# EAGLE board tigor_mbed_rev_b_print (EAGLE 6.3)
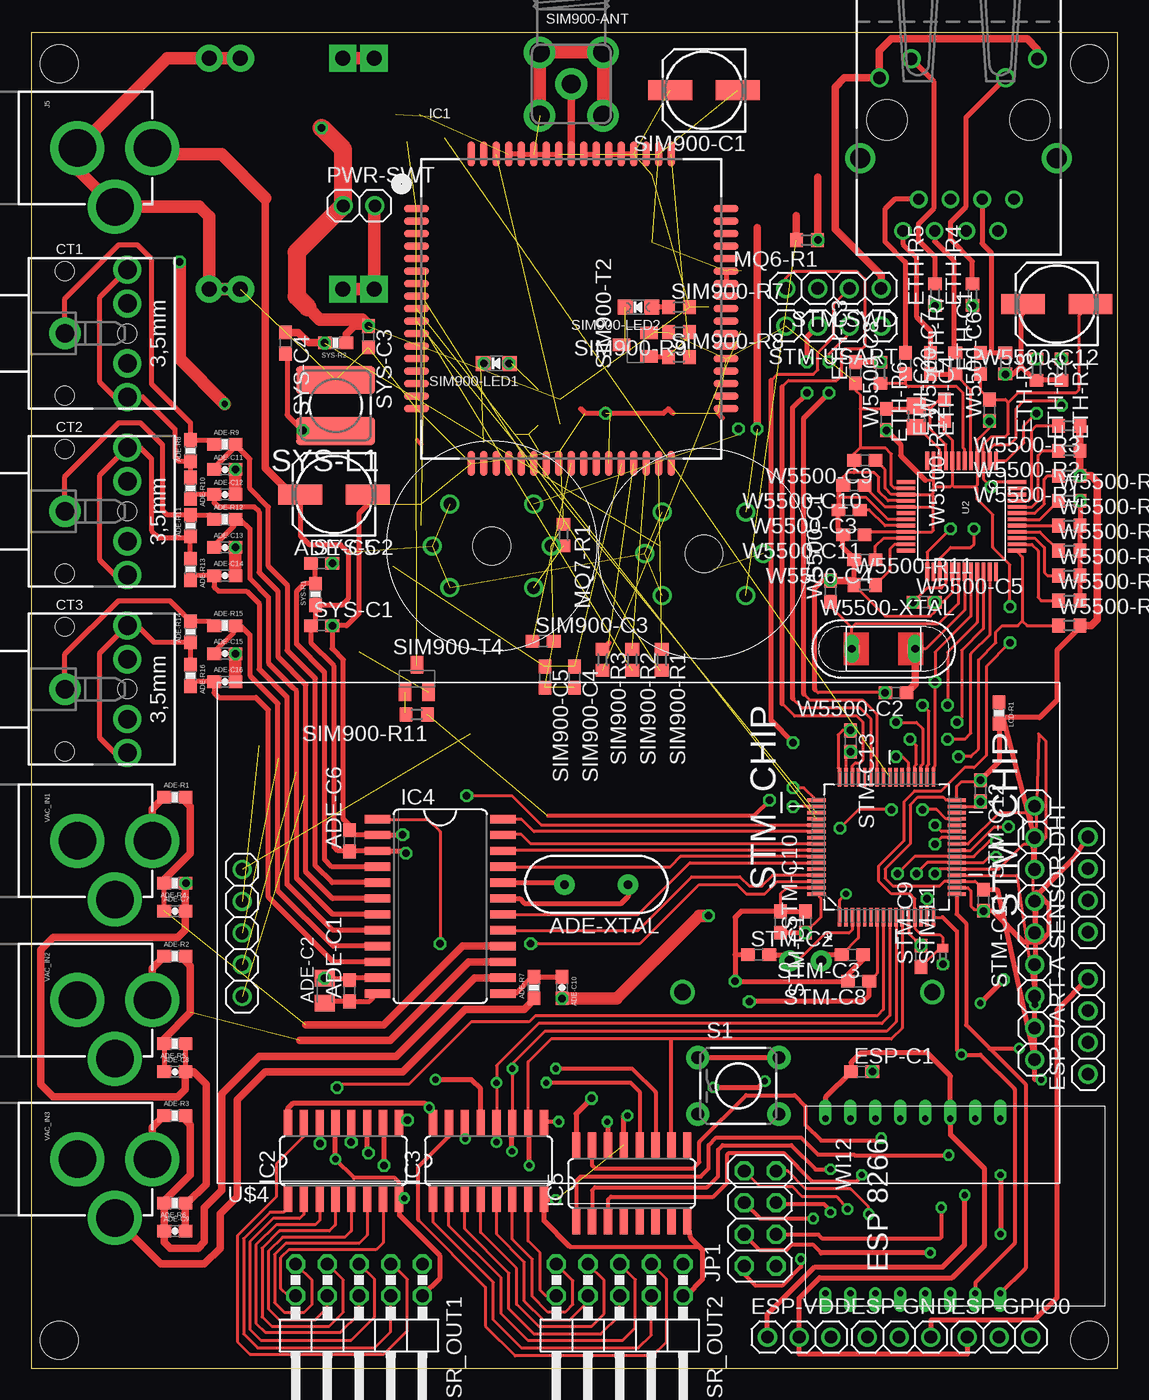
[diagram p2: board, top side]
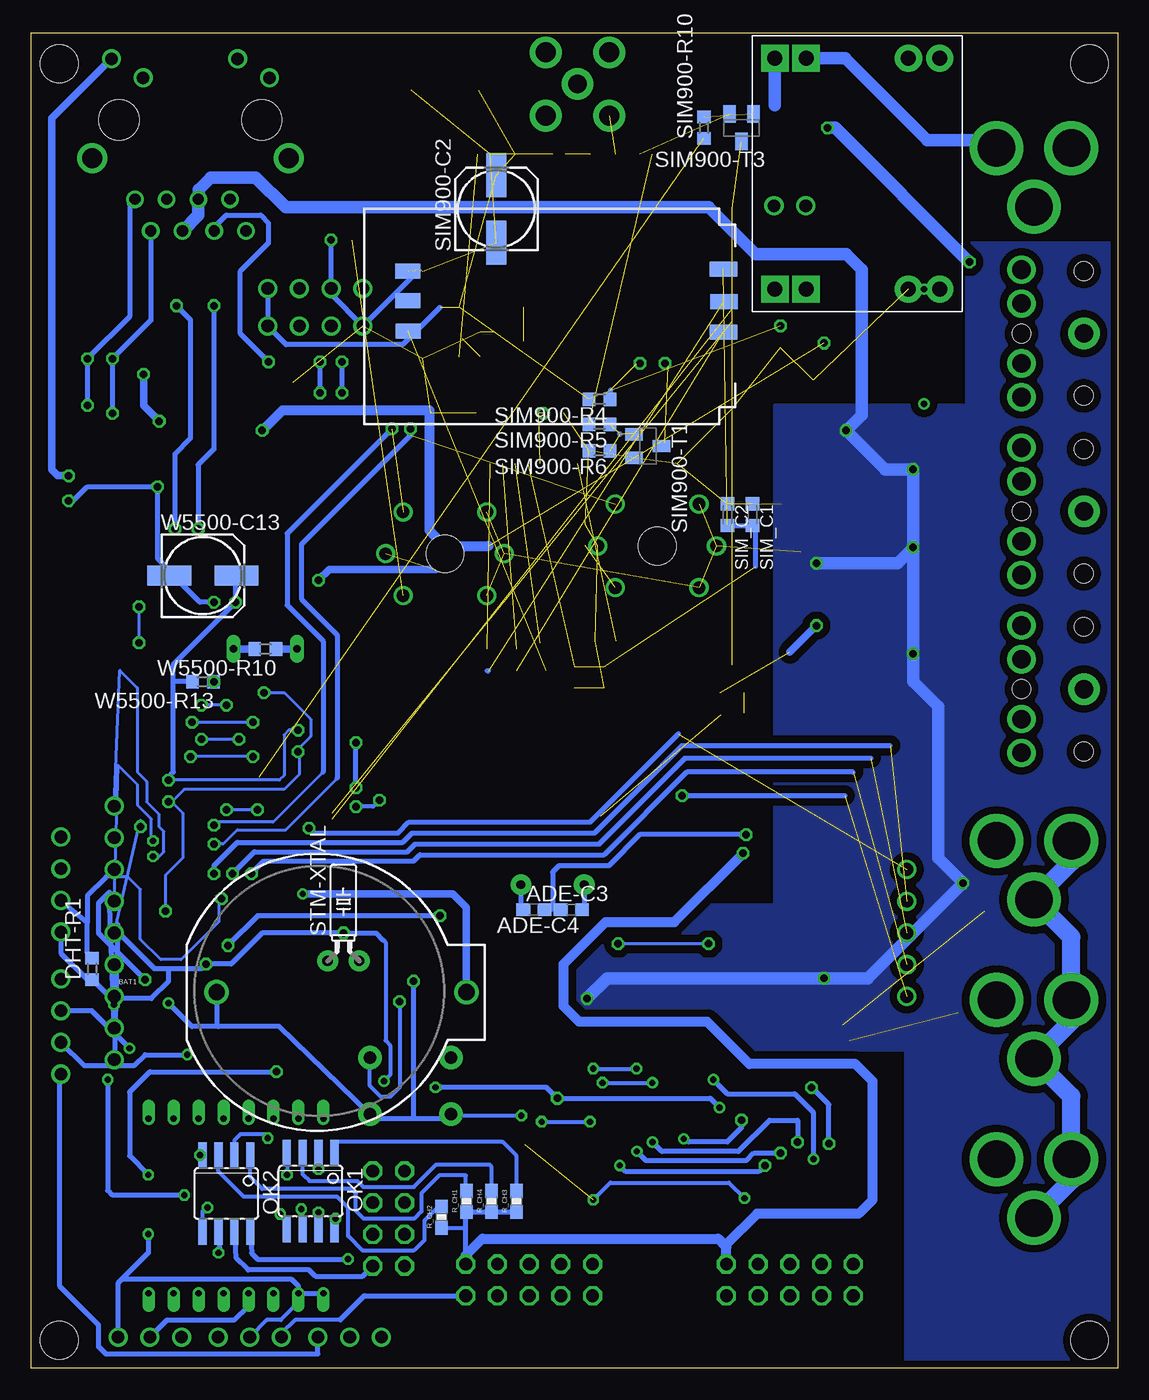
[diagram p3: board, bottom side, seen from below]

Size 87 x 107 mm. Coordinates in mm from the lower left corner, seen from the top.
Outline: 87,0 87,107 0,107 0,0 87,0
Copper layers (1*16): Top 0.035mm / dielectric 1.5mm / Bottom 0.035mm
Design rules "default *": minimum track width 10mil, minimum drill 10mil, track to track 0.125mm, track to pad 0.125mm, pad to pad 0.125mm, via to via 0.125mm, smd to smd 0mil, copper to edge 0.5mm, drill to drill 0.2mm, minimum pad ring 10mil, minimum via ring 8mil, stop-mask expansion 4mil, vias tented up to drill 0mil, thermal gap 10mil
Net classes: 1 power: width 0.305 mm, drill 0.6 mm, clearance 0.254 mm; 2 gnd: width 0.254 mm, drill 0.6 mm, clearance 0.254 mm
Holes 3 mm at 2.25,2.25 84.75,2.25 2.25,104.5 84.75,104.5

## Footprints (pad centres in the part's own frame; a part is rotated, then mirrored left to right if it is on the bottom)
C0603 = smd 1.1 x 1: 1 -0.85,0; 2 0.85,0
C0805K = smd 1.3 x 1.6: 1 -1,0; 2 1,0
153CLV-0605 = smd 3.5 x 1.6: + 2.7,0; - -2.7,0
0603-CAP = smd 1.1 x 1: 1 -0.85,0; 2 0.85,0
0603-RES = smd 1.1 x 1: 1 -0.85,0; 2 0.85,0
HC49US = drill 0.7 pad 1.651: 1 -2.54,0; 2 2.54,0
BATTCOM_20MM_PTH = drill 1.3: 1 11.85,0; 2 -8.15,0
STX3100 = drill 1.5 pad 2.54: 1 2.7,-0.1 | drill 1.5: 2 7.7,5; 3 7.7,2.3; 4 7.7,-2.5; 5 7.7,-5.2 | hole 1.5: 2.7,4.9; 2.7,-5.1; 7.7,-0.1
DCDCMODULE-SMALL = drill 1.2 pad 2.184: INM#1 1.8,15; INM#2 1.8,12.5; OUTM#1 20.3,15; OUTM#2 20.3,12.5 | drill 1.2 pad 2.184 square: INP#1 1.8,4.3; INP#2 1.8,1.8; OUTP#1 20.3,4.3; OUTP#2 20.3,1.8
R0603 = smd 1 x 1.1: 1 -0.85,0; 2 0.85,0
1X03 = drill 1.016: 1 -2.54,0; 2 0,0; 3 2.54,0
PINHD4 = drill 1.016: 1 -3.81,0; 2 -1.27,0; 3 1.27,0; 4 3.81,0
RJ45_PULSEJACK = drill 0.9: 1 4.445,-6.35; 2 3.175,-8.89; 3 1.905,-6.35; 4 0.635,-8.89; 5 -0.635,-6.35; 6 -1.905,-8.89; 7 -3.175,-6.35; 8 -4.445,-8.89 | drill 1: 9 6.325,4.9; 10 3.785,3.38; 11 -3.785,4.9; 12 -6.325,3.38 | drill 1.6: P$5 -7.875,-3.05; P$6 7.875,-3.05 | hole 3.2: -5.715,0; 5.715,0
SIM900_SMT = smd 2 x 0.6: P$1 -12.4,8; P$2 -12.4,7; P$3 -12.4,6; P$4 -12.4,5; P$5 -12.4,4; P$6 -12.4,3; P$7 -12.4,2; P$8 -12.4,1; P$9 -12.4,0; P$10 -12.4,-1; P$11 -12.4,-2; P$12 -12.4,-3; P$13 -12.4,-4; P$14 -12.4,-5; P$15 -12.4,-6; P$16 -12.4,-7; P$17 -12.4,-8; P$35 12.4,-8; P$36 12.4,-7; P$37 12.4,-6; P$38 12.4,-5; P$39 12.4,-4; P$40 12.4,-3; P$41 12.4,-2; P$42 12.4,-1; P$43 12.4,0; P$44 12.4,1; P$45 12.4,2; P$46 12.4,3; P$47 12.4,4; P$48 12.4,5; P$49 12.4,6; P$50 12.4,7; P$51 12.4,8 | smd 0.6 x 2: P$18 -8,-12.4; P$19 -7,-12.4; P$20 -6,-12.4; P$21 -5,-12.4; P$22 -4,-12.4; P$23 -3,-12.4; P$24 -2,-12.4; P$25 -1,-12.4; P$26 0,-12.4; P$27 1,-12.4; P$28 2,-12.4; P$29 3,-12.4; P$30 4,-12.4; P$31 5,-12.4; P$32 6,-12.4; P$33 7,-12.4; P$34 8,-12.4; P$52 8,12.4; P$53 7,12.4; P$54 6,12.4; P$55 5,12.4; P$56 4,12.4; P$57 3,12.4; P$58 2,12.4; P$59 1,12.4; P$60 0,12.4; P$61 -1,12.4; P$62 -2,12.4; P$63 -3,12.4; P$64 -4,12.4; P$65 -5,12.4; P$66 -6,12.4; P$67 -7,12.4; P$68 -8,12.4
SO16 = smd 0.66 x 2.032: 1 -4.445,-3.073; 2 -3.175,-3.073; 3 -1.905,-3.073; 4 -0.635,-3.073; 5 0.635,-3.073; 6 1.905,-3.073; 7 3.175,-3.073; 8 4.445,-3.073; 9 4.445,3.073; 10 3.175,3.073; 11 1.905,3.073; 12 0.635,3.073; 13 -0.635,3.073; 14 -1.905,3.073; 15 -3.175,3.073; 16 -4.445,3.073
SOIC24 = smd 0.66 x 2.032: 1 -6.985,-5.029; 2 -5.715,-5.029; 3 -4.445,-5.029; 4 -3.175,-5.029; 5 -1.905,-5.029; 6 -0.635,-5.029; 7 0.635,-5.029; 8 1.905,-5.029; 9 3.175,-5.029; 10 4.445,-5.029; 11 5.715,-5.029; 12 6.985,-5.029; 13 6.985,5.029; 14 5.715,5.029; 15 4.445,5.029; 16 3.175,5.029; 17 1.905,5.029; 18 0.635,5.029; 19 -0.635,5.029; 20 -1.905,5.029; 21 -3.175,5.029; 22 -4.445,5.029; 23 -5.715,5.029; 24 -6.985,5.029
POWER_JACK_PTH = drill 2.997 pad 4.318: GND 0,7.7; GNDBREAK 4.7,10.7; PWR 0,13.7
2X04 = drill 1.016 octagon: 1 -3.81,-1.27; 2 -3.81,1.27; 3 -1.27,-1.27; 4 -1.27,1.27; 5 1.27,-1.27; 6 1.27,1.27; 7 3.81,-1.27; 8 3.81,1.27
SOIC08 = smd 0.66 x 2.032: 1 -1.905,-3.073; 2 -0.635,-3.073; 3 0.635,-3.073; 4 1.905,-3.073; 5 1.905,3.073; 6 0.635,3.073; 7 -0.635,3.073; 8 -1.905,3.073
PINHD2 = drill 1.016: 1 -1.27,0; 2 1.27,0
TACTILE-PTH = drill 1.016 pad 1.88: 1 -3.251,2.261; 2 3.251,2.261; 3 -3.251,-2.261; 4 3.251,-2.261
MQ-3 = drill 1.016: A1 -3.35,3.35; A2 -3.35,-3.35; B1 3.35,3.35; B2 3.35,-3.35; HA -4.75,0; HB 4.75,0 | hole 3: 0,0
SMA90_DIP = drill 1.5 pad 2.54: ANTENNA 0,0 | drill 1.6 pad 2.54: GND1 -2.54,2.54; GND2 2.54,2.54; GND3 -2.54,-2.54; GND4 2.54,-2.54
CHIPLED_0805_NOOUTLINE = smd 1.2 x 1.2: A 0,-1.05; C 0,1.05
SOT23-BEC = smd 1 x 1.4: B -0.95,-1.1; C 0,1.1; E 0.95,-1.1
C0603K = smd 1.05 x 1.08: 1 -0.875,0; 2 0.875,0
SIMHOLDER3 = smd 2.2 x 1.2: 1 0.95,4.81; 2 0.91,7.41; 3 0.95,9.86 | smd 2 x 1.2: 4 26.2,9.78; 5 26.22,7.34; 6 26.22,4.98
2X05/90 = drill 1.016 octagon: 1 -5.08,-6.35; 2 -5.08,-3.81; 3 -2.54,-6.35; 4 -2.54,-3.81; 5 0,-6.35; 6 0,-3.81; 7 2.54,-6.35; 8 2.54,-3.81; 9 5.08,-6.35; 10 5.08,-3.81
0402 = smd 0.7 x 0.9: 1 -0.65,0; 2 0.65,0
TC26H = drill 0.813 pad 1.676: 1 -1.27,0; 2 1.27,0
QFP50P1200X1200X160-64N = smd 1.473 x 0.279: 1 -5.613,3.759; 2 -5.613,3.251; 3 -5.613,2.743; 4 -5.613,2.261; 5 -5.613,1.753; 6 -5.613,1.245; 7 -5.613,0.762; 8 -5.613,0.254; 9 -5.613,-0.254; 10 -5.613,-0.762; 11 -5.613,-1.245; 12 -5.613,-1.753; 13 -5.613,-2.261; 14 -5.613,-2.743; 15 -5.613,-3.251; 16 -5.613,-3.759; 33 5.613,-3.759; 34 5.613,-3.251; 35 5.613,-2.743; 36 5.613,-2.261; 37 5.613,-1.753; 38 5.613,-1.245; 39 5.613,-0.762; 40 5.613,-0.254; 41 5.613,0.254; 42 5.613,0.762; 43 5.613,1.245; 44 5.613,1.753; 45 5.613,2.261; 46 5.613,2.743; 47 5.613,3.251; 48 5.613,3.759 | smd 0.279 x 1.473: 17 -3.759,-5.613; 18 -3.251,-5.613; 19 -2.743,-5.613; 20 -2.261,-5.613; 21 -1.753,-5.613; 22 -1.245,-5.613; 23 -0.762,-5.613; 24 -0.254,-5.613; 25 0.254,-5.613; 26 0.762,-5.613; 27 1.245,-5.613; 28 1.753,-5.613; 29 2.261,-5.613; 30 2.743,-5.613; 31 3.251,-5.613; 32 3.759,-5.613; 49 3.759,5.613; 50 3.251,5.613; 51 2.743,5.613; 52 2.261,5.613; 53 1.753,5.613; 54 1.245,5.613; 55 0.762,5.613; 56 0.254,5.613; 57 -0.254,5.613; 58 -0.762,5.613; 59 -1.245,5.613; 60 -1.753,5.613; 61 -2.261,5.613; 62 -2.743,5.613; 63 -3.251,5.613; 64 -3.759,5.613
POWER-CHOKE_WE-TPC = smd 6.3 x 2.2: 1 0,2.05; 2 0,-2.05
W5500 = smd 1.5 x 0.3: 1 -4.45,2.75; 2 -4.45,2.25; 3 -4.45,1.75; 4 -4.45,1.25; 5 -4.45,0.75; 6 -4.45,0.25; 7 -4.45,-0.25; 8 -4.45,-0.75; 9 -4.45,-1.25; 10 -4.45,-1.75; 11 -4.45,-2.25; 12 -4.45,-2.75; 25 4.45,-2.75; 26 4.45,-2.25; 27 4.45,-1.75; 28 4.45,-1.25; 29 4.45,-0.75; 30 4.45,-0.25; 31 4.45,0.25; 32 4.45,0.75; 33 4.45,1.25; 34 4.45,1.75; 35 4.45,2.25; 36 4.45,2.75 | smd 0.3 x 1.5: 13 -2.75,-4.45; 14 -2.25,-4.45; 15 -1.75,-4.45; 16 -1.25,-4.45; 17 -0.75,-4.45; 18 -0.25,-4.45; 19 0.25,-4.45; 20 0.75,-4.45; 21 1.25,-4.45; 22 1.75,-4.45; 23 2.25,-4.45; 24 2.75,-4.45; 37 2.75,4.45; 38 2.25,4.45; 39 1.75,4.45; 40 1.25,4.45; 41 0.75,4.45; 42 0.25,4.45; 43 -0.25,4.45; 44 -0.75,4.45; 45 -1.25,4.45; 46 -1.75,4.45; 47 -2.25,4.45; 48 -2.75,4.45
CRISTAL-ABM7 = smd 1.27 x 0.635: P$1 -2.54,0; P$2 2.54,0
TFT_LCD_2.2+F_CS = drill 1.016: F_CS -31.86,5.08; LCD_CS 31.6,-5.08; LCD_D/C 31.6,0; LCD_GND 31.6,-7.62; LCD_LED 31.6,7.62; LCD_MISO 31.6,10.16; LCD_MOSI 31.6,2.54; LCD_RESET 31.6,-2.54; LCD_SCK 31.6,5.08; LCD_VCC 31.6,-10.16; SD_CS -31.86,-5.08; SD_MISO -31.86,0; SD_MOSI -31.86,-2.54; SD_SCK -31.86,2.54
WI12 = drill 0.5 pad 0.813 offset: ADC 10.4,1; CH_PD 12.4,1; GND 22.4,15; GPIO00 16.4,15; GPIO02 18.4,15; GPIO04 12.4,15; GPIO05 14.4,15; GPIO12 18.4,1; GPIO13 20.4,1; GPIO14 16.4,1; GPIO15 20.4,15; GPIO16 14.4,1; REST 8.4,1; RXD 10.4,15; TXD 8.4,15; VCC 22.4,1
R0805 = smd 1.3 x 1.5: 1 -0.85,0; 2 0.85,0
QS = drill 0.61 long: 1 -2.54,0; 2 2.54,0

## Placement (x,y rotation side)
ADE-C1  0.1uF  [C0603]  25.5,30.25 90 top
ADE-C2  10uF  [C0805K]  23.5,30.25 90 top
ADE-C3  22pF  [C0603]  46.75,36.75 0 bottom
ADE-C4  22pF  [C0603]  43.75,36.75 180 bottom
ADE-C5  10uF  [153CLV-0605]  24.25,70 180 top
ADE-C6  100nF  [C0603]  25.5,42.25 90 top
ADE-C7  33nF  [0603-CAP]  11.5,36.62 0 top
ADE-C8  33nF  [0603-CAP]  11.5,23.75 0 top
ADE-C9  33nF  [0603-CAP]  11.5,11 0 top
ADE-C10  33nF  [0603-CAP]  42.5,30.5 270 top
ADE-C11  33nF  [0603-CAP]  15.5,72 0 top
ADE-C12  33nF  [0603-CAP]  15.5,70 0 top
ADE-C13  33nF  [0603-CAP]  15.5,65.75 0 top
ADE-C14  33nF  [0603-CAP]  15.5,63.5 0 top
ADE-C15  33nF  [0603-CAP]  15.5,57.25 0 top
ADE-C16  33nF  [0603-CAP]  15.5,55 0 top
ADE-R1  81K  [0603-RES]  11.5,45.75 0 top
ADE-R2  81K  [0603-RES]  11.5,33 0 top
ADE-R3  81K  [0603-RES]  11.5,20.25 0 top
ADE-R4  1K  [0603-RES]  11.5,38.88 180 top
ADE-R5  1K  [0603-RES]  11.5,26 180 top
ADE-R6  1K  [0603-RES]  11.5,13.25 180 top
ADE-R7  1K  [0603-RES]  40.25,30.5 90 top
ADE-R8  33R  [0603-RES]  12.75,73.5 90 top
ADE-R9  1K  [0603-RES]  15.5,74 0 top
ADE-R10  1K  [0603-RES]  12.75,70.5 270 top
ADE-R11  33R  [0603-RES]  12.75,67.5 90 top
ADE-R12  1K  [0603-RES]  15.5,68 0 top
ADE-R13  1K  [0603-RES]  12.75,64 270 top
ADE-R14  33R  [0603-RES]  12.75,59 90 top
ADE-R15  1K  [0603-RES]  15.5,59.5 0 top
ADE-R16  1K  [0603-RES]  12.75,55.5 270 top
ADE-XTAL  10MHz  [HC49US]  45.25,38.75 180 top
BAT1  [BATTCOM_20MM_PTH]  64,30.12 0 bottom
CT1  100A  [STX3100]  0,83 0 top
CT2  100A  [STX3100]  0,68.75 0 top
CT3  100A  [STX3100]  0,54.5 0 top
DCDC-3.5V  DCDCMODULE_SMALL  [DCDCMODULE-SMALL]  29.25,106.75 270 bottom
DHT-R1  10k  [R0603]  82.12,32 90 bottom
ESP-C1  100nF  [C0603]  66.5,23.75 0 top
ESP-GND  [1X03]  69.5,2.5 0 top
ESP-GPIO0  [1X03]  77.5,2.5 0 top
ESP-UART-A  PINHD4  [PINHD4]  84.62,27.38 90 top
ESP-VDD  [1X03]  61.5,2.5 0 top
ETH-C1  22nF  [C0603]  76,80.5 90 top
ETH-C2  6.8nF  [C0603]  70,80.5 270 top
ETH-C3  10nF  [C0603]  66,79.75 90 top
ETH-C4  6.8nF  [C0603]  72,80.5 270 top
ETH-R1  49R9  [R0603]  82.5,80 270 top
ETH-R2  49R9  [R0603]  80.5,80 270 top
ETH-R3  10R  [R0603]  78,80.5 270 top
ETH-R4  330  [R0603]  75.38,86 90 top
ETH-R5  330  [R0603]  72.38,86 90 top
ETH-R6  49R9  [R0603]  68,79.75 270 top
ETH-R7  49R9  [R0603]  74,80.5 90 top
ETHERNET  [RJ45_PULSEJACK]  74.25,100 0 top
IC1  SIM900  [SIM900_SMT]  43.25,84.88 0 top
IC2  74HC595D  [SO16]  25,16.62 0 top
IC3  74HC595D  [SO16]  36.62,16.62 0 top
IC4  ADE7758RW  [SOIC24]  32.75,37 270 top
IC5  74HC595D  [SO16]  48.09,14.81 0 top
J5  POWER_JACKPTH  [POWER_JACK_PTH]  -4,97.75 270 top
JP1  [2X04]  58.38,12 90 top
LCD-R1  680R  [0603-RES]  77.5,52.5 270 top
MQ6-R1  10k  [R0603]  62.12,90.38 180 top
MQ7-R1  10k  [R0603]  42.62,66.75 270 top
OK1  ILD205  [SOIC08]  64.62,14.2 180 bottom
OK2  ILD205  [SOIC08]  71.38,14 180 bottom
PWR-SWT  PINHD2  [PINHD2]  26.25,93.12 0 top
R_CH1  270  [0603-RES]  52.12,13.38 90 bottom
R_CH2  270  [0603-RES]  54.14,12.11 90 bottom
R_CH3  270  [0603-RES]  48.12,13.38 90 bottom
R_CH4  270  [0603-RES]  50.12,13.38 90 bottom
S1  [TACTILE-PTH]  56.62,22.62 0 top
SENSOR-DHT  PINHD4  [PINHD4]  84.62,38.75 90 top
SENSOR-MQ6  METHANE_SENSOR  [MQ-3]  53.88,65.25 0 top
SENSOR-MQ7  METHANE_SENSOR  [MQ-3]  36.88,65.88 0 top
SIM900-ANT  [SMA90_DIP]  43.25,102.88 0 top
SIM900-C1  100uF  [153CLV-0605]  53.88,102.38 180 top
SIM900-C2  100uF  [153CLV-0605]  49.75,92.88 90 bottom
SIM900-C3  4u7  [C0603]  41,58.25 0 top
SIM900-C4  100nF  [C0603]  43.5,55.38 270 top
SIM900-C5  22pF  [C0603]  41.12,55.38 270 top
SIM900-LED1  [CHIPLED_0805_NOOUTLINE]  37.25,80.5 90 top
SIM900-LED2  [CHIPLED_0805_NOOUTLINE]  48.62,85 90 top
SIM900-R1  22R  [R0603]  50.5,56.75 270 top
SIM900-R2  22R  [R0603]  48.12,56.75 270 top
SIM900-R3  22R  [R0603]  45.75,56.75 270 top
SIM900-R4  680R  [R0603]  41.5,77.62 180 bottom
SIM900-R5  1K  [R0603]  41.5,75.62 180 bottom
SIM900-R6  10K  [R0603]  41.5,73.5 180 bottom
SIM900-R7  680R  [R0603]  51.88,85 0 top
SIM900-R8  1K  [R0603]  51.88,81 0 top
SIM900-R9  10K  [R0603]  51.88,83 180 top
SIM900-R10  120R  [R0603]  33.12,99.38 90 bottom
SIM900-R11  120R  [R0603]  30.88,52.38 180 top
SIM900-T1  [SOT23-BEC]  37.62,73.88 270 bottom
SIM900-T2  [SOT23-BEC]  48.38,82 90 top
SIM900-T3  [SOT23-BEC]  30.12,99.38 180 bottom
SIM900-T4  [SOT23-BEC]  30.88,55.25 0 top
SIM_C1  100nF  [C0603K]  29.25,68.38 270 bottom
SIM_C2  22pF  [C0603K]  31.25,68.38 270 bottom
SIM_HOLDER  SIMHOLDER3  [SIMHOLDER3]  30.62,92.88 180 bottom
SR_OUT1  [2X05/90]  26.25,2 180 top
SR_OUT2  [2X05/90]  47.12,2 180 top
STM-C1  1uF  [C0603]  60,35.75 270 top
STM-C2  4.3pF  [C0603]  58.25,33.12 0 top
STM-C3  4.3pF  [C0603]  65.75,33.12 180 top
STM-C8  100nF  [C0603]  66.25,31 180 top
STM-C9  100nF  [C0603]  71.25,33 90 top
STM-C10  100nF  [C0603]  62,35.75 90 top
STM-C11  100nF  [C0603]  76.25,37.5 270 top
STM-C12  100nF  [C0603]  76,46.25 270 top
STM-C13  100nF  [C0603]  65.62,50.25 270 top
STM-L1  BLM15HB121SN1  [0402]  73,33 90 top
STM-SWD  PINHD4  [PINHD4]  64.25,86.5 180 top
STM-USART  PINHD4  [PINHD4]  64.25,83.5 180 top
STM-XTAL  32.768kHz  [TC26H]  62,32.62 0 bottom
STM_CHIP  STM32F103RBT6  [QFP50P1200X1200X160-64N]  68.5,41.75 90 top
SYS-C1  0.1uF  [C0603]  23.25,59.5 0 top
SYS-C2  0.1uF  [C0603]  23.25,64.5 0 top
SYS-C3  0.1uF  [C0603]  27,82.62 270 top
SYS-C4  0.1uF  [C0603]  20.38,82.12 270 top
SYS-L1  150Mhz  [POWER-CHOKE_WE-TPC]  24.38,77.12 180 top
SYS-R1  10R  [0603-RES]  22.75,62 90 top
SYS-R2  10R  [0603-RES]  24.38,82.12 180 top
U2  W5500  [W5500]  74.5,68.25 270 top
U$3  CRISTAL-ABM7  [CRISTAL-ABM7]  68.25,57.62 0 top
U$4  TFT_LCD_2.2+F_CS  [TFT_LCD_2.2+F_CS]  48.75,34.88 0 top
U$5  ESP8266WI12  [WI12]  86,21 180 top
VAC_IN1  9V  [POWER_JACK_PTH]  -4,42.25 270 top
VAC_IN2  9V  [POWER_JACK_PTH]  -4,29.5 270 top
VAC_IN3  9V  [POWER_JACK_PTH]  -4,16.75 270 top
W5500-C1  18pF  [C0603]  64,62.25 90 top
W5500-C2  18pF  [C0603]  69.25,54.12 180 top
W5500-C3  4.7uF  [C0603]  65.5,68.75 180 top
W5500-C4  10nF  [C0603]  66.75,64.75 180 top
W5500-C5  100nF  [C0603]  71.5,61.38 0 top
W5500-C6  100nF  [C0603]  76.75,76.75 90 top
W5500-C7  100nF  [C0603]  73.12,76.75 90 top
W5500-C8  100nF  [C0603]  68.5,76 90 top
W5500-C9  100nF  [C0603]  66.75,72.75 180 top
W5500-C10  100nF  [C0603]  65.88,70.75 180 top
W5500-C11  100nF  [C0603]  65.88,66.75 180 top
W5500-C12  10uF/16V  [153CLV-0605]  82.12,85.25 180 top
W5500-C13  10uF/16V  [153CLV-0605]  73.25,63.5 0 bottom
W5500-R1  10k  [R0603]  83.12,71.5 180 top
W5500-R2  10k  [R0603]  83.12,73.5 180 top
W5500-R3  10k  [R0603]  83.12,75.5 180 top
W5500-R4  10k  [R0603]  83.12,69.5 0 top
W5500-R5  10k  [R0603]  83.12,67.5 0 top
W5500-R6  10k  [R0603]  83.12,65.5 0 top
W5500-R7  10k  [R0603]  83.12,63.5 0 top
W5500-R8  10k  [R0603]  83.12,61.5 0 top
W5500-R9  10k  [R0603]  83.12,59.5 0 top
W5500-R10  1M  [R0603]  68.25,57.62 180 bottom
W5500-R11  10k  [R0603]  66.75,62.75 0 top
W5500-R12  12K4  [R0805]  70.88,76.25 270 top
W5500-R13  10k  [R0603]  73.25,55 180 bottom
W5500-XTAL  25MHz  [QS]  68.25,57.62 0 top

## Tracks (layer width: path | path; a pad name or v marks a point on that pad's centre or on a via)
+5V  (via drill 0.6)  (6 unrouted)
  Top 0.406: 25.55,41.45 24.55,41.45 24.25,41.75 24.25,56.25 22.4,58.1 SYS-C1.1 22.75,59.85 SYS-R1.1 24.9,61.15 25.38,61.62 25.38,65.38 24.75,66 22.25,66 21.55,66.7 ADE-C5.+ | 25.55,41.45 IC4.3 29.8,41.45 v30,41.25 | 25.55,41.45 ADE-C6.1
  Top 0.61: ADE-C5.+ 20.88,70 18.75,72.12 18.75,93.75
  Top 1.016: DCDC-3.5V.INP#2 DCDC-3.5V.INP#1 | 18.75,93.75 15.25,97.25 10.2,97.25 J5.PWR
  Bottom 0.305: 52.23,11.65 52.2,11.62 | R_CH2.1 52.2,11.26
  Bottom 0.406: R_CH3.1 R_CH4.1 R_CH1.1 52.2,12.45 52.2,11.62 52.2,11.26 52.2,9.04
  Bottom 0.813: SR_OUT2.1 52.2,9.04 50.88,10.38 32,10.38 31.33,9.71 | SR_OUT1.1 31.33,9.71 | 31.33,9.71 31.33,9.92 28.88,12.38 20.75,12.38 19.62,13.5 19.62,23 21,24.38 29.5,24.38 32.88,27.75 43.12,27.75 44.38,29 44.38,32.38 41,35.75 35.5,35.75 v30,41.25
  Bottom 1.016: DCDC-3.5V.INP#2 27.45,101.17 | DCDC-3.5V.INP#1 21.83,104.95 15.25,98.38 10.33,98.38 J5.PWR
ACTLED  (via drill 0.6)
  Top 0.254: U2.27 72.75,64.88 73.62,65.75 75.25,65.75 75.5,66 v75.5,67.25
  Top 0.406: ETH-R4.1 v75.38,85.12
  Bottom 0.406: v75.38,85.12 74.25,84 74.25,74.5 75.5,73.25 v75.5,67.25
ADE_APCF  (via drill 0.6)
  Top 0.254: IC4.1 31.77,43.98 32.75,43 v32.75,34 | STM_CHIP.62 59.75,39 58.75,38 57.25,38 56.5,38.75 53.5,38.75 48.75,34 v40,34
  Bottom 0.254: v32.75,34 v40,34
ADE_CS
  Top 0.254: STM_CHIP.58 51.99,40.99 51.17,40.17 IC4.21
ADE_IRQ
  Top 0.254: IC4.18 48.62,36.37 52.75,40.5 STM_CHIP.59
ADE_MISO
  Top 0.254: 37.79,44 IC4.24 | 37.89,43.88 IC4.24 | STM_CHIP.54 40.25,43 39.27,43.98 IC4.24 | 38.01,43.75 IC4.24
ADE_MOSI
  Top 0.254: STM_CHIP.57 37.83,41.5 IC4.22
ADE_SCK
  Top 0.254: STM_CHIP.56 40,42 39.25,42.75 37.81,42.75 IC4.23
ADE_VARCF
  Top 0.254: IC4.17 48.59,35.09 52.88,39.38 56.75,39.38 57.5,38.62 58.5,38.62 59.38,39.5 59.39,39.49 STM_CHIP.61
AGND  (via drill 0.6)
  Top 0.254: STM_CHIP.12 70.25,34.85 STM-C9.2 v71.25,33.88 | v16.38,65.75 ADE-C13.2 | v12.38,38.88 ADE-R4.1 | ADE-C10.2 v42.5,29.62
  Top 0.305: ADE-C11.2 v16.38,72
  Top 0.406: ADE-R5.1 ADE-C8.2 | IC4.11 25.69,31.29 ADE-C1.2 25.35,31.25 ADE-C2.2 | SYS-L1.1 21.75,75.08 v21.75,75.12 20.5,76.38 20.5,81.15 SYS-C4.2 | v16.38,57.25 ADE-C15.2 | v24.12,64.5 SYS-C2.2
  Top 0.61: ADE-R4.1 ADE-C7.2 12.35,35.1 11.75,34.5 1.75,34.5 0.75,33.5 0.75,22.75 1.75,21.75 11.75,21.75 12.35,22.35 ADE-C8.2 13,23.75 14,22.75 14,14.75 12.5,13.25 ADE-R6.1 ADE-C9.2
  Top 1.016: ADE-C13.2 ADE-C14.2 | ADE-C15.2 ADE-C16.2 | ADE-C11.2 ADE-C12.2 | v42.5,29.62 46.88,29.62 53.5,36.25 v54.25,36.25
  Bottom 0.406: v42.5,29.62 42.38,29.62 | v54.25,36.25 68.88,36.25 v71.25,33.88
  Bottom 0.61: ETHERNET.5 73.6,93.65
  Bottom 1.016: ETHERNET.5 73.61,92.38 ETHERNET.4 | 73.6,93.65 73.6,94.4 72.62,95.38 69,95.38 66.62,93 32.75,93 29,89.25 21.75,89.25 20.5,88 20.5,76.38 v21.75,75.12 18.62,72 v16.38,72 v16.38,65.75 | v16.38,65.75 v16.38,57.25 16.38,55 14.38,53 14.38,40.88 v12.38,38.88 20,31.25 ADE-C2.2 40.88,31.25 v42.5,29.62 | v24.12,64.5 17.62,64.5 v16.38,65.75
  other vias: 23.5,31.25
  pour Bottom (isolate 0.61): -0.12,90.12 12.12,90.12 12.12,77.38 12.12,77.12 27.5,77.12 27.5,57.12 27.5,52.75 27.5,40.5 27.5,37.12 45.12,37.12 45.12,25.5 17,25.5 17,4.75 17,-0.25 -0.25,-0.25 -0.25,2.38 -0.25,23.62 -0.25,33.62 -0.25,90.12
AVDD
  Top 0.406: IC4.4 24.08,40.17 23.5,40.75 23.5,55.75 21.25,58 21.25,62.25 21.85,62.85 SYS-R1.2 22.75,64.15 SYS-C2.1
CH1_A  (via drill 0.5)
  Top 0.305: v61.62,8.75 61.62,8.12 60.12,6.62 58,6.62 57.11,7.52 JP1.2
  Top 0.406: 57.11,7.89 JP1.2
  Bottom 0.406: OK2.8 69.34,9.22 68.88,8.75 v61.62,8.75
CH1_B
  Bottom 0.406: OK2.7 70.61,8.87 69.64,7.89 64.76,7.89 64.25,7.38 60.46,7.38 JP1.1
CH1_IN  (via drill 0.5)
  Top 0.305: IC5.15 44.91,16.25 45.16,16 53,16 53.5,16.5 53.5,18.12 57.25,21.88 61.12,21.88 62,21 62,19.5 63.25,18.25 67.88,18.25 v68.06,18.44
  Bottom 0.305: v68.06,18.44 68.38,18.75 70.25,18.75 70.74,18.26 OK2.2
CH2_A  (via drill 0.5)
  Top 0.305: 63.25,9.25 62.62,9.88 60.88,9.88 60.46,9.46 58.33,9.46 57.11,10.68 JP1.4
  Top 0.406: v72,9.25 63.25,9.25
  Bottom 0.406: OK2.6 71.89,9.38 v72,9.25
CH2_B  (via drill 0.5)
  Top 0.305: v72.88,12.88 72.88,10.5 72.75,10.38 63.36,10.38 63.02,10.71 59.66,10.71 JP1.3
  Bottom 0.305: OK2.5 73.28,12.6 v72.88,12.88
CH2_IN  (via drill 0.5)
  Top 0.305: IC5.1 43.65,15 44.02,15.38 53.62,15.38 54.25,16 54.25,17.88 54.88,18.5 61.62,18.5 63,17.12 65.88,17.12 65.93,17.07 73.46,17.07 v73.47,17.09
  Bottom 0.254: v73.47,17.09 73.21,17.09
  Bottom 0.305: OK2.4 73.46,17.07 v73.47,17.09
CH3_A  (via drill 0.5)
  Top 0.305: v62.62,12 58.38,12 JP1.6 57.11,13.39
  Bottom 0.305: OK1.8 62.72,12.25 v62.62,12
CH3_B  (via drill 0.5)
  Top 0.305: JP1.5 59.78,13.14 63.49,13.14 64,12.62 v64,12.5
  Bottom 0.305: v64,12.5 v63.99,12.49 OK1.7
CH3_IN  (via drill 0.5)
  Top 0.305: IC5.2 44.91,14.25 45.16,14.5 54.12,14.5 55,15.38 55,17.5 55.38,17.88 60.88,17.88 62.81,15.94 v64,15.94
  Bottom 0.305: v64,15.94 OK1.2
CH4_A  (via drill 0.5)
  Top 0.254: v65.38,12.75 64.5,13.75 61.75,13.75 60.96,14.54 58.38,14.54 JP1.8
  Bottom 0.254: OK1.6 65.38,11.24 v65.38,12.75
CH4_B  (via drill 0.5)
  Top 0.254: v67.06,12.36 67.06,12.93 65.61,14.38 62,14.38 60.56,15.81 JP1.7
  Bottom 0.254: OK1.5 66.53,11.83 v67.06,12.36
CH4_IN  (via drill 0.5)
  Top 0.305: IC5.3 46.19,13.5 46.44,13.75 54.62,13.75 55.75,14.88 55.75,17.12 55.88,17.25 60.25,17.25 62.51,14.99 66.12,14.99 66.51,15.38 v66.51,15.5
  Bottom 0.305: OK1.4 66.51,17.26 v66.51,15.5
DC_VOUT
  Top 1.016: PWR-SWT.2 27.45,93.06 DCDC-3.5V.OUTP#2 DCDC-3.5V.OUTP#1
DGND  (via drill 0.5, 0.6)  (36 unrouted)
  Top 0.254: STM_CHIP.18 75,38.5 75.25,38.25 75.25,37 75.5,36.75 76.15,36.75 STM-C11.2 v76.25,36.62 | STM_CHIP.31 75.6,45 STM-C12.2 v76,45.38 | STM_CHIP.63 60.5,38.5 60,38 STM-C1.1 | U2.14 69.12,70.5 68.88,70.75 68.88,73.25 68.38,73.75 66.38,73.75 | U2.16 68.62,69.5 67.88,70.25 67.88,71.38 67.5,71.75 65.88,71.75 | U2.19 68.62,68 66.88,69.75 64.65,69.75 | 66.38,73.75 65.9,73.28 W5500-C9.2 65.9,71.78 65.88,71.75 | STM_CHIP.47 65.25,49.02 STM-C13.2 65.35,49.38 v65.62,49.38 | 65.88,71.75 65.38,71.75 65.03,71.4 W5500-C10.2 | U2.9 73.25,74 72,75.25 72,76.88 | 66,79 ETH-C3.1 66,78.38 66.38,78 66.38,76.88 | 65.55,63.1 W5500-R11.1 65.9,62.73 68.38,60.25 72,60.25 72.38,60.62 72.38,61.35 W5500-C5.2 | W5500-C2.2 v68.38,54.12 63,54.12 62.75,54.38 | 66.38,76.88 66.38,73.75 | 78.25,77.38 78.03,77.6 W5500-C6.2 76,78.35 ETH-C1.1 | 72,76.88 71.78,77.1 W5500-R12.1 70.78,76.88 68.53,76.88 W5500-C8.2 66.4,76.85 66.38,76.88 | U2.48 77.25,71 v76.88,70.62 76.25,71.25 U2.3 76.25,74 76.88,74.62 78,74.62 78.25,74.88 78.25,77.38 | W5500-C12.- 83.88,84.3 83.88,78.38 83.62,78.12 79,78.12 78.25,77.38 | U2.29 73.75,62.12 73,61.38 v72.38,61.38 | W5500-C7.2 72.72,77.6 72,76.88
  Top 0.305: 43.12,9.75 53.5,9.75 | v24.37,16.75 25.87,15.25 29.12,15.25 29.45,14.93 29.45,14.12 29.45,13.93 | 29.45,13.93 IC2.8 29.52,13.62 v29.88,13.62 | 29.45,13.93 29.5,13.88 | IC3.8 41.12,13.5 v42,13.5
  Top 0.406: IC2.8 29.45,14.12 29.57,14.25 | ADE-C5.- 26.95,69.2 26.25,68.5 26.25,60.5 25.25,59.5 v24.12,59.5 SYS-C1.2 24.1,57.65 25,56.75 25,44 25.5,43.5 ADE-C6.2 25.88,42.72 IC4.2 29.72,42.72 v29.75,42.75 | STM-C10.2 STM-C1.1 56.85,36.6 56.38,36.12 56.38,33.12 | IC1.P$61 IC1.P$62 IC1.P$63 IC1.P$64 IC1.P$65 | IC1.P$59 IC1.P$58 | IC1.P$46 IC1.P$45 | SIM900-T4.E 32.1,54.15 | 49.9,83 SIM900-T2.E | 56.38,33.12 v56.38,31 STM-C8.2 65.38,31.02 65.38,31.5 66.6,32.73 STM-C3.1 | STM-C11.2 76.28,36.62 77,36.62 79.5,34.12 80.75,34.12 81.5,34.88 81.5,37.12 80.62,38 | SR_OUT1.2 31.33,5.83 32.75,7.25 32.75,9 29.5,12.25 29.5,13.88 | MQ6-R1.1 63,90.35 v63,90.38 | U$4.LCD_GND 80.5,38.13 80.62,38 | 55.38,76.12 55,76.5 | 51.38,76.5 51,76.88 50.62,76.5 46.38,76.5 46,76.88 45.62,76.5 44.38,76.5 44,76.88 | 62.75,54.38 62.75,62.5 63.38,63.12 v64,63.12 W5500-C1.2 | W5500-R11.1 W5500-C4.2 65.9,64.85 65,65.75 65,66.72 W5500-C11.2 65.03,66.85 64.62,67.25 64.62,68.72 W5500-C3.2 64.65,69.75 64.65,70.38 W5500-C10.2 | W5500-R8.2 W5500-R7.2 W5500-R6.2 W5500-R5.2 84,67.53 v84,69.5 W5500-R4.2 | v72.38,61.38 W5500-C5.2 | STM-C2.1 56.38,33.12 | v76,29.25 v77.88,31.12 | SENSOR-DHT.4 83.44,40.81 80.62,38 | SR_OUT2.2 52.44,5.81 53.75,7.12 53.75,9.5 53.5,9.75 52.78,10.46 IC5.8 | 43.12,9.75 41.07,11.8 IC3.8 | IC3.13 35.99,22.39 35.25,23.12 v32.38,23.12 | v24.37,16.75 IC2.13 | 47.7,20.2 v47.75,20.25 47.45,20.25 IC5.13
  Top 0.61: 65.55,63.1 W5500-C1.2 | MQ6-R1.1 62.98,95.4
  Top 1.016: DCDC-3.5V.OUTM#2 v15.5,86.45 DCDC-3.5V.OUTM#1 14.25,92.25 13.45,93.05 J5.GNDBREAK 3.7,96.05 J5.GND 10.9,104.95 DCDC-3.5V.INM#1 DCDC-3.5V.INM#2 16.8,104.95 | SIM900-ANT.GND3 SIM900-ANT.GND1 SIM900-ANT.GND2 SIM900-ANT.GND4
  Bottom 0.254: 75.75,45.38 74.88,44.5 74.88,40.88 76.25,39.5 v76.25,36.62 | v68.38,54.12 66.75,54.12 64.62,52 64.62,50.62 65.62,49.62 v65.62,49.38 65.5,49.25 65.5,47.62 66.75,46.38 74.75,46.38 75.75,45.38 | 75.75,45.38 v76,45.38
  Bottom 0.305: 62.25,3.88 65.88,3.88 66.96,2.79 ESP-GND.1 | 53.62,20.12 53.5,20.25 v47.75,20.25 | v42,13.5 40.62,14.88 31.12,14.88 v29.88,13.62
  Bottom 0.406: ADE-C4.2 45.38,36.75 | 45.38,36.75 ADE-C3.2 | v29.75,42.75 38.25,42.75 40.75,40.25 44.75,40.25 45.25,39.75 45.25,36.88 45.38,36.75 | v77.88,31.12 81.62,34.88 81.62,37.25 80.75,38.13 U$4.LCD_GND | 63.02,90.23 v63,90.38 62.98,90.36 STM-SWD.3 62.98,86.04 STM-USART.4 55.94,88 | v84,69.5 83.62,69.5 82.5,70.62 v76.88,70.62 76.88,64.88 75.95,63.95 W5500-C13.- 75.58,63.12 75.25,63.12 73.5,61.38 v72.38,61.38 | 56.38,19.99 v56.38,31 | 72,27.38 67.14,27.38 S1.4 59.88,19.99 56.38,19.99 | 72,27.38 74.12,27.38 v76,29.25 | BAT1.2 72.15,27.52 72,27.38 | 56.38,19.99 53.76,19.99 53.62,20.12 S1.3 | 62.25,3.88 60.31,5.81 SR_OUT2.2 | v32.38,23.12 31.25,22 25.88,22 24.37,20.49 v24.37,16.75
  Bottom 0.61: v64,63.12 63.12,64 54.62,64 | v24.12,59.5 26.25,57.38
  other vias: 46,76.5
  cutout Bottom (isolate 0.61): -0.25,107.12 87.12,107.12 87.12,-0.25 17.88,-0.25 17.88,24.62 46,24.62 46,38 28.38,38 28.5,78 13,78 13,91 -0.25,91
  cutout Top (isolate 0.61): 29.25,107 57.25,107 57.25,70.25 29.25,70.25
DHT_DATA  (via drill 0.6)
  Top 0.254: STM_CHIP.15 v71.75,37.62
  Bottom 0.254: 81,39.38 79.25,39.38 78.25,38.38 78.25,34.38 76.62,32.75 75,32.75 72,35.75 72,37.38 v71.75,37.62
  Bottom 0.406: 81,39.38 82.5,37.88 82.5,35.73 | SENSOR-DHT.2 82.5,35.73 | DHT-R1.2 82.5,33.23 82.5,35.73
ESP_GPIO0
  Bottom 0.406: ESP-GPIO0.2 76.12,3.88 70.75,3.88 69.6,5.03 U$5.GPIO00
ESP_RX  (via drill 0.5)
  Top 0.254: STM_CHIP.16 72.99,36.14
  Top 0.305: 72.99,36.14 74.12,35 74.12,25.5 v74.5,25.12 76,25.12 78.75,22.38 78.75,10 75.6,6.85 U$5.RXD
  Bottom 0.305: 77.75,25.12 v74.5,25.12
  Bottom 0.406: ESP-UART-A.2 82.77,24.25 78.75,24.25 77.88,25.12 v74.5,25.12
ESP_TX  (via drill 0.5)
  Top 0.305: STM_CHIP.17 74.11,36.39 74.88,35.62 74.88,27.5 76.75,25.62 | 76.75,25.62 v79.12,25.62 | 76.75,25.62 79.62,22.75 79.62,8.03 U$5.TXD
  Bottom 0.406: v79.12,25.62 82.14,28.64 ESP-UART-A.3
ETH_CS  (via drill 0.6)
  Top 0.254: U2.32 75.25,60.25 72.38,57.38 v72.38,55 72.38,48.25 72.26,48.13 STM_CHIP.33
  Bottom 0.406: W5500-R13.1 v72.38,55
ETH_MISO  (via drill 0.6)
  Top 0.254: U2.34 76.25,59.25 74.5,57.5 74.5,52.12 v74.12,51.75 | STM_CHIP.35 71.24,48.24 71.38,48.38 71.38,51.25 70.88,51.75 v69.25,51.75
  Bottom 0.254: v69.25,51.75 v74.12,51.75
ETH_MOSI  (via drill 0.6)
  Top 0.254: U2.35 76.75,58.75 75.25,57.25 75.25,50.88 74.75,50.38 v73.38,50.38 | STM_CHIP.36 70.76,48.26 70.88,48.38 70.88,49.88 v70.38,50.38
  Bottom 0.254: v70.38,50.38 v73.38,50.38
ETH_RSTN  (via drill 0.6)
  Top 0.254: v74.25,49 75.25,49 75.88,49.62 75.88,56.75 77.25,58.12 77.25,59 77.75,59.5 79,59.5 79.38,59.88 | 79.38,59.88 79.38,65 78.95,65.42 U2.37 | W5500-R9.1 79.75,59.5 79.38,59.88 | v69.25,49 69.75,49 70.25,48.5 STM_CHIP.37
  Bottom 0.254: v69.25,49 v74.25,49
ETH_SCK  (via drill 0.6)
  Top 0.254: U2.33 75.75,59.75 73.38,57.38 v73.38,53.12 | STM_CHIP.34 71.75,48.25 71.88,48.38 71.88,52.62 v71.38,53.12
  Bottom 0.254: v71.38,53.12 v73.38,53.12
F_CS  (via drill 0.6)  (1 unrouted)
  Top 0.254: STM_CHIP.29 73.24,44.01 72.5,44.75 v71.38,44.75 | v68.88,44.75 66.25,44.75 v64.75,43.25
  Bottom 0.254: v71.38,44.75 v68.88,44.75
  Bottom 0.406: v64.75,43.25 64.38,42.88 57.62,42.88 56.75,43.75 42.25,43.75 35.17,50.83
GESP  (via drill 0.5, 0.6)
  Top 0.406: v67.38,23.75 ESP-C1.2 | v77.62,15.5 v77.62,10.75
  Bottom 0.305: U$5.GPIO15 65.6,5.28 67,3.88 68.12,3.88 ESP-GND.2
  Bottom 0.406: U$5.GND U$5.GPIO15 65.6,6.6 66.12,7.12 79.75,7.12 | ESP-GPIO0.3 80.04,6.83 79.75,7.12 | ESP-C1.2 v67.38,23.75 77.5,23.75 79.12,22.12 79.12,17 v77.62,15.5 | v77.62,10.75 77.62,9.25 79.75,7.12
GEXT
  Top 0.406: ESP-UART-A.4 82.16,28.72 82.16,5.66 80.38,3.88 72.04,3.88 ESP-GND.3
IBN
  Top 0.406: CT2.5 6.7,63.55 5.5,64.75 5.5,71.55 CT2.2 8.75,73.75 9.62,72.88 9.62,67.12 10.25,66.5 12.65,66.5 ADE-R11.1 ADE-R13.1
ICN
  Top 0.406: ADE-R16.1 ADE-R14.1 9.85,58.15 8.5,59.5 CT3.2 5.5,57.3 5.5,50.5 6.7,49.3 CT3.5
LCD_CS
  Top 0.254: STM_CHIP.20 78.92,39.49 U$4.LCD_CS
LCD_D/C  (via drill 0.6)
  Top 0.254: STM_CHIP.24 75.25,41.5 77.12,43.38 v78.25,43.38
  Bottom 0.254: U$4.LCD_D/C 78.25,43.9 v78.25,43.38
LCD_LED
  Top 0.406: LCD-R1.1 77.52,53.37 U$4.LCD_LED
LCD_MISO  (via drill 0.5, 0.6)  (1 unrouted)
  Top 0.254: v77.25,41 76.75,41 76.25,40.5 75.76,40.5 75.75,40.51 STM_CHIP.22 71.75,40.51 v70.88,39.62
  Bottom 0.254: v77.25,41 76.75,41 76.38,41.38 76.38,43 76.75,43.38 76.75,44.38 77.75,45.38 77.75,47 78.5,47.75 78.5,54.5 79.91,55.91 U$4.LCD_MISO
  Bottom 0.406: 19.77,48.88 34.62,48.88 41.5,42 56.25,42 56.88,41.38 69.12,41.38 v70.88,39.62
LCD_MOSI  (via drill 0.5, 0.6)  (1 unrouted)
  Top 0.254: v77.25,42.25 76.75,42.25 75.49,40.99 STM_CHIP.23 70.74,40.99 v69.38,39.62
  Bottom 0.254: v77.25,42.25 77.38,42.38 77.38,44 78.5,45.12 78.5,46.75 80.04,48.29 U$4.LCD_MOSI
  Bottom 0.406: 21.18,47.75 34.5,47.75 41.12,41.12 55.88,41.12 56.38,40.62 68.38,40.62 v69.38,39.62
LCD_RESET
  Top 0.254: STM_CHIP.25 75,42 77.5,44.5 79.75,44.5 80.1,44.15 U$4.LCD_RESET
LCD_SCK  (via drill 0.6)  (1 unrouted)
  Top 0.254: v72.38,39.62 72.75,40 STM_CHIP.21 77.5,40 79.5,42 80.75,42 81.25,42.5 81.25,50.25 80.67,50.83 U$4.LCD_SCK
  Bottom 0.406: v72.38,39.62 72.38,40.25 70.5,42.12 57.25,42.12 56.5,42.88 41.88,42.88 34.88,49.88 18.22,49.88
LINKLED  (via drill 0.6)
  Top 0.254: U2.25 71.75,65.38 v73.62,67.25 | ETH-R5.1 v72.38,85.12
  Bottom 0.406: v72.38,85.12 72.38,73.62 73.62,72.38 v73.62,67.25
MQ6_DATA  (via drill 0.6)  (1 unrouted)
  Top 0.254: STM_CHIP.26 72.89,42.51 v72.38,42
  Bottom 0.254: 62.5,47.25 66.62,43.12 70.5,43.12 71.62,42 v72.38,42
  Bottom 0.406: v56.62,75.25 56.62,74.75 65.38,66 65.38,61.62 62.5,58.75 62.5,47.25
MQ7_DATA  (via drill 0.6)  (1 unrouted)
  Top 0.254: STM_CHIP.27 72.88,42.99 v72.38,43.5
  Top 0.61: 58.12,91.38 v58.12,75.25
  Bottom 0.254: 63.62,47.75 67.62,43.75 72.12,43.75 v72.38,43.5
  Bottom 0.406: v58.12,75.25 66.5,66.88 66.5,61.12 63.62,58.25 63.62,47.75
N$1
  Top 0.254: STM_CHIP.3 65.76,35.13 65.5,34.88 63.62,34.88 61.38,32.62 STM-XTAL.2
  Top 0.406: STM-C2.2 60.23,33.12 STM-XTAL.2
N$2
  Top 0.254: STM_CHIP.4 66.24,34.46 STM-C3.2
  Top 0.406: STM-C3.2 63.77,33.12 STM-XTAL.1
N$3  (1 unrouted)
  Top 0.406: 46.25,58.1 SIM900-R3.1
N$5
  Bottom 0.305: R_CH1.2 52.2,14.3 52.2,15.45 54.34,15.45 55.76,14.03 55.76,12.56 56.34,11.99 60.38,11.99 61,12.61 61,14 61.38,14.38 68.5,14.38 68.62,14.5 68.94,14.81 69.47,15.35 OK2.1
N$6
  Bottom 0.305: 54.41,13.35 R_CH2.2 54.36,12.96 55.49,11.84 55.49,10.29 56.31,9.46 60.48,9.46 61.62,10.61 61.62,12.88 62.5,13.75 70,13.75 72.01,15.76 OK2.3 | 72,16.5 72.01,16.51 OK2.3 | OK2.3 71.96,17.12 71.88,17.12 71.88,17.06
N$7
  Bottom 0.305: R_CH3.2 48.12,17 49.25,18.12 62.72,18.12 OK1.1 62.75,17.1 62.75,18
N$8  (1 unrouted)
N$9  (1 unrouted)
  Top 0.61: 61.27,92.35 MQ6-R1.2
N$10
  Top 0.61: ADE-R3.2 12.35,19.9 12.75,19.5 12.75,15.5 10.65,13.4 ADE-R6.2 ADE-C9.1 10.65,10.1 11.12,9.62 13.38,9.62 13.88,10.12 13.88,12.88 15.25,14.25 15.25,22 18.25,25 29.25,25 35.53,31.29 IC4.14
N$11
  Top 0.406: ETH-R4.2 75.38,88.69 73.62,90.44 73.62,91.81 74.88,93.06 74.88,100.22 ETHERNET.10
N$12
  Top 0.406: ETH-R5.2 72.38,89 71.06,90.31 71.06,91.69 72.31,92.94 72.31,103.05 ETHERNET.11
N$13  (1 unrouted)
  Top 0.406: 50.27,57.6 SIM900-R1.1
N$14  (1 unrouted)
N$15
  Top 0.61: IC1.P$60 SIM900-ANT.ANTENNA
N$16  (via drill 0.6)  (1 unrouted)
  Top 0.406: 38.5,80.5 SIM900-LED1.A v38.25,80.5
  Bottom 0.406: v38.25,80.5 38.5,80.5 | 40.62,78.38 40.62,77.65 SIM900-R4.1
N$17  (via drill 0.6)  (1 unrouted)
  Top 0.406: v36.25,80.5 36,80.3 SIM900-LED1.C
  Bottom 0.406: 36.25,74.15 SIM900-T1.C
N$18  (3 unrouted)
  Bottom 0.406: 40.6,75.58 SIM900-R5.1 40.65,75.6 | 39.85,74.83 39.89,74.86
N$19
  Top 0.406: SIM900-R7.1 SIM900-LED2.A
N$20  (1 unrouted)
  Top 0.406: 47.58,82.3 SIM900-T2.C
N$21  (1 unrouted)
  Top 0.406: SIM900-T2.B 49.52,81 SIM900-R8.1 51.02,81.03 | 52.5,82.5 52.5,82.78 SIM900-R9.1
N$22
  Top 0.406: ETHERNET.7 69.15,93.65 68.38,92.88 68.38,90.25 70,88.62 ETH-C2.1
N$23
  Top 0.406: ETHERNET.3 76.16,90.09 76.88,89.38 76.88,81.35 | ETH-C1.2 76.88,81.35 | 76.88,81.35 ETH-R3.1
N$24
  Top 0.406: 14.75,57.35 ADE-C15.1 14.65,57.4 16.25,59 16.25,59.4 ADE-R15.2 16.35,59.35 16.9,59.35 17.5,58.75 17.5,55.5 19.75,53.25 19.75,38.25 24.17,33.83 IC4.9
N$25
  Top 0.406: CT2.1 2.7,71.45 7,75.75 8.75,75.75 10.5,74 10.5,68.75 10.9,68.35 ADE-R11.2 14.3,68.35 ADE-R12.1
N$26
  Top 0.406: ETHERNET.8 69.81,90.07 70.88,89 70.88,84.25 72,83.12 ETH-C4.1
N$27
  Top 0.406: IC4.5 24.09,38.91 22.75,40.25 22.75,55.25 20.5,57.5 20.5,62.75 19,64.25 19,69 17.5,70.5 17.5,72.85 ADE-R9.2 16.35,73.85 14.65,72.15 ADE-C11.1
N$28
  Top 0.406: IC4.6 24.12,37.63 22,39.75 22,54.75 19.75,57 19.75,62.25 18.25,63.75 18.25,68.62 17.88,69 15,69 14.65,69.35 ADE-C12.1 13.1,70 ADE-R10.2
N$29  (via drill 0.6)
  Top 0.406: ETHERNET.6 72.34,90.28 73.88,88.75 73.88,81.47 ETH-R7.2 | ETH-C3.2 ETH-R6.1 v68,80.62
  Bottom 0.406: ETHERNET.6 72.34,91.41 71.38,92.38 68.62,92.38 68,91.75 68,90.12 70.25,87.88 70.25,82.88 v68,80.62
N$30
  Top 0.406: ADE-R13.2 13.1,63.5 ADE-C14.1 14.65,62.6 15,62.25 17.25,62.25 18.25,61.25 18.25,56 20.5,53.75 20.5,38.75 24.16,35.09 IC4.8
N$31
  Top 0.406: ADE-C13.1 14.65,65.9 16.25,67.5 16.25,67.9 ADE-R12.2 16.75,68 17.5,67.25 17.5,63.25 19,61.75 19,56.5 21,54.5 21.25,54.25 21.25,39.25 24.13,36.37 IC4.7
N$32
  Top 0.406: IC4.12 27.11,29.4 ADE-C1.1 23.65,29.4 ADE-C2.1
N$33
  Top 0.406: IC4.19 39.12,37.63 39.5,37.25 47.25,37.25 47.79,37.79 ADE-XTAL.1
  Bottom 0.406: ADE-XTAL.1 47.79,36.94 ADE-C3.1
N$34
  Top 0.406: IC4.20 42.55,38.91 ADE-XTAL.2
  Bottom 0.406: ADE-XTAL.2 42.71,36.94 ADE-C4.1
N$35
  Top 0.406: IC4.13 37.79,30 38.75,30 40.1,31.35 ADE-R7.2 ADE-C10.1
N$36
  Top 0.61: VAC_IN2.PWR 9.7,32.05 ADE-R2.1
N$37  (1 unrouted)
  Top 0.406: ADE-R5.2 ADE-C8.1
  Top 0.61: ADE-R2.2 12.35,32.65 12.75,32.25 12.75,28.5 10.65,26.4 ADE-R5.2 | IC4.15 35.05,32.55 28.75,26.25 21.5,26.25
N$38
  Top 0.254: U2.20 68.38,67.5 67.12,68.75 W5500-C3.1
N$39
  Top 0.406: CT1.1 2.7,85.7 7,90 8.5,90 9.62,88.88 9.62,78.88 12.75,75.75 ADE-R8.2 14.3,74.35 ADE-R9.1
N$40
  Top 0.406: ADE-R16.2 13.1,55 ADE-C16.1 14.65,54.1 15,53.75 18,53.75 19,52.75 19,37.75 24.2,32.55 IC4.10
N$41
  Top 0.254: W5500-C4.1 67.6,65.85 68.25,66.5 U2.22
N$42
  Top 0.254: U2.23 69.12,66 68.75,65.62 68.75,63.9 W5500-R11.2
N$43  (1 unrouted)
N$44  (1 unrouted)
N$45  (1 unrouted)
  Top 0.305: 29.92,52.48 SIM900-R11.2
N$46
  Bottom 0.305: R_CH4.2 50.12,16.12 50.34,16.34 54.55,16.34 56.36,14.53 60.4,14.53 60.88,15 64.71,15 65.26,15.55 OK1.3
N$47
  Top 0.406: CT1.2 5.5,85.8 5.5,79 6.7,77.8 CT1.5 8.95,77.8 11.5,75.25 11.5,73 11.85,72.65 ADE-R8.1 ADE-R10.1
N$48
  Top 0.406: CT3.1 2.7,57.2 7,61.5 11.1,61.5 ADE-R14.2 14.3,59.85 ADE-R15.1
N$50
  Top 0.254: U2.31 74.75,60.75 71.62,57.62 U$3.P$2
  Top 0.61: U$3.P$2 70.79,54.81 W5500-C2.1
  Bottom 0.61: W5500-R10.2 U$3.P$2
N$51
  Top 0.254: U2.10 72.75,73.62 71.5,74.88 71.4,74.88 W5500-R12.2 70.75,75
N$52  (1 unrouted)
  Top 0.406: ADE-C7.1 ADE-R4.2
  Top 0.61: ADE-R1.2 12.35,45.4 12.75,45 12.75,41.25 10.65,39.15 ADE-R4.2 | IC4.16 34.58,33.83 28.25,27.5 22,27.5
N$54
  Top 0.61: VAC_IN1.PWR 9.7,44.8 ADE-R1.1
N$55
  Top 0.61: VAC_IN3.GNDBREAK 10.38,8.38 13.88,8.38 15.12,9.62 15.12,12.38 16.5,13.75 16.5,21.5 18.75,23.75 29.75,23.75 34.75,28.75 39.5,28.75 40.25,29.5 ADE-R7.1
  Bottom 1.422: VAC_IN1.GND 3.7,40.55 VAC_IN1.GNDBREAK 3.7,34.55 VAC_IN2.GND 3.7,27.8 VAC_IN2.GNDBREAK 3.7,21.8 VAC_IN3.GND 3.7,15.05 VAC_IN3.GNDBREAK
N$57
  Top 0.254: U2.38 80.12,66 80.62,65.5 80.62,61.75 80.88,61.5 W5500-R8.1
N$58
  Top 0.254: U2.39 80.38,66.5 81.12,65.75 81.12,63.75 81.38,63.5 W5500-R7.1
N$59
  Top 0.254: U2.40 80.78,67 W5500-R6.1
N$60
  Top 0.254: U2.41 W5500-R5.1
N$61
  Top 0.254: U2.42 80.78,68 W5500-R4.1
N$62
  Top 0.254: U2.43 80.38,68.5 81.12,69.25 81.12,71.25 81.38,71.5 W5500-R1.2
N$63
  Top 0.254: U2.44 80.12,69 80.62,69.5 80.62,73.12 81,73.5 W5500-R2.2
N$64
  Top 0.254: W5500-R3.2 80.5,75.5 80.12,75.12 80.12,69.75 79.88,69.5 U2.45
N$65
  Top 0.61: VAC_IN3.PWR 9.7,19.3 ADE-R3.1
N$66
  Top 0.254: U2.30 74.25,61.25 72.62,59.62 66,59.62 65.71,59.34 | U$3.P$1 65.71,59.34 | W5500-C1.1 64,61.05 65.71,59.34
  Bottom 0.61: W5500-R10.1 U$3.P$1
Q1
  Top 0.254: IC2.15 21.83,18.57 19.62,16.38 19.62,13.75 16.5,10.62 16.5,2.12 17.5,1.12 28.25,1.12 30.12,3 30.12,7.12 28.9,8.35 SR_OUT1.3
Q2
  Top 0.254: 20.56,12.8 20.25,12.5 19.12,12.5 17,10.38 17,2.75 18.12,1.62 27.5,1.62 28.79,2.92 SR_OUT1.4
  Top 0.305: IC2.1 20.56,12.8
Q3
  Top 0.254: IC2.2 21.83,12.32 21.5,12 19.38,12 17.5,10.12 17.5,3.12 18.38,2.25 25.62,2.25 27.5,4.12 27.5,7.12 26.27,8.35 SR_OUT1.5
Q4
  Top 0.254: IC2.3 23.09,11.85 22.75,11.5 19.62,11.5 18,9.88 18,3.62 18.75,2.88 24.75,2.88 26.25,4.38 SR_OUT1.6
Q5
  Top 0.254: IC2.4 24.37,11.49 23.88,11 19.88,11 18.5,9.62 18.5,4.12 19.25,3.38 23.88,3.38 25,4.5 25,7.08 23.73,8.35 SR_OUT1.7
Q6
  Top 0.254: IC2.5 25.63,11.01 25.12,10.5 20.12,10.5 19,9.38 19,4.75 19.88,3.88 22.75,3.88 23.71,4.83 SR_OUT1.8
Q7
  Top 0.254: IC2.6 26.91,10.65 26.25,10 20.38,10 19.5,9.12 19.5,5.25 20.25,4.5 21.88,4.5 22.5,5.12 22.5,7.04 21.19,8.35 SR_OUT1.9
Q8
  Top 0.254: IC2.7 28.17,10.05 27.62,9.5 20.62,9.5 20,8.88 20,6.38 20.56,5.81 SR_OUT1.10
Q9
  Top 0.254: SR_OUT2.3 50.88,7.14 50.88,2.12 49.75,1 38.75,1 36.38,3.38 36.38,6.5 31,11.88
  Top 0.305: 31,11.88 31,16.12 33.45,18.57 IC3.15
Q10
  Top 0.254: IC3.1 32.18,11.7 37,6.88 37,3.88 39.25,1.62 48.62,1.62 49.66,2.67 SR_OUT2.4
Q11
  Top 0.254: SR_OUT2.5 48.38,7.1 48.38,3.25 47.38,2.25 39.75,2.25 37.62,4.38 37.62,7.25 33.45,11.43 IC3.2
Q12
  Top 0.254: IC3.3 34.72,11.15 38.25,7.62 38.25,4.75 40.25,2.75 45.62,2.75 47.12,4.25 SR_OUT2.6
Q13
  Top 0.254: SR_OUT2.7 45.88,7.06 45.88,4.38 44.88,3.38 40.62,3.38 38.88,5.12 38.88,8 35.99,10.88 IC3.4
Q14
  Top 0.254: 44.59,5.46 SR_OUT2.8 44.59,5.33 43.12,3.88 41,3.88 39.5,5.38 39.5,8.5 37.26,10.74 IC3.5
Q15
  Top 0.254: SR_OUT2.9 43.38,7.02 43.38,5.12 42.75,4.5 41.38,4.5 40.12,5.75 40.12,8.75 38.53,10.35 IC3.6
Q16
  Top 0.254: SR_OUT2.10 41.19,5.81 40.75,6.25 40.75,9.25 39.8,10.2 IC3.7
QS  (via drill 0.5, 0.6)
  Top 0.406: 29.45,19.95 IC2.9 29.45,19.88 v30.12,19.88 | v34.75,18.38 34.72,18.47 IC3.14
  Bottom 0.406: v34.75,18.38 34.38,18.12 31.25,18.12 30.12,19.25 v30.12,19.88
QS2  (via drill 0.5)
  Top 0.305: v42.25,19.75 41.12,19.75 IC3.9
  Top 0.406: v46.12,19.75 46.19,19.69 IC5.14
  Bottom 0.305: v46.12,19.75 v42.25,19.75
RXN
  Top 0.254: U2.5 75.25,78.38 74,79.62 ETH-R7.1
  Top 0.406: ETH-C4.2 ETH-R7.1
RXP
  Top 0.254: U2.6 74.75,73.62 74.62,73.75 74.62,78.12 74.12,78.62 70.25,78.62 70,78.88 | ETH-C2.2 70,78.88 | ETH-R6.2 69.97,78.9 70,78.88
SD_CS  (via drill 0.6)  (1 unrouted)
  Top 0.254: STM_CHIP.53 40.88,43.5 38.5,45.88 v34.88,45.88
  Bottom 0.406: v34.88,45.88 21.84,45.88
SERIAL_RX  (via drill 0.6)
  Top 0.254: STM_CHIP.43 67.25,51.99 66.38,52.88 61.75,52.88 61,53.62
  Top 0.406: 61,53.62 61,77 v62.12,78.12 | v62.12,80.62 62.12,82.64 STM-USART.3
  Bottom 0.406: v62.12,80.62 v62.12,78.12
SERIAL_TX  (via drill 0.6)
  Top 0.254: STM_CHIP.42 67.74,52.39 66.62,53.5 62.38,53.5 61.88,54 | v63.88,80.62 63.88,81.25 65.52,82.89 STM-USART.2
  Top 0.406: 61.88,54 61.88,76.12 v63.88,78.12
  Bottom 0.406: v63.88,80.62 v63.88,78.12
SIM900_PWRKEY  (2 unrouted)
  Top 0.305: 30.88,74.38 31.25,74
SIM900_RESET  (1 unrouted)
SIM_NETLIGHT  (1 unrouted)
  Top 0.406: 53,80.9 SIM900-R8.2
SIM_PWRKEY  (1 unrouted)
SIM_RESET  (via drill 0.6)  (1 unrouted)
  Top 0.254: STM_CHIP.50 v61,45
  Top 0.305: v59.12,45.5 57.88,44.25 41.38,44.25
  Bottom 0.305: v59.12,45.5 59.62,45 v61,45
SIM_RX  (1 unrouted)
SIM_STATUS  (1 unrouted)
SIM_TX  (1 unrouted)
SR_DS  (via drill 0.6)
  Top 0.254: v24.5,22.5 24.75,22.75 30.25,22.75 35.25,27.75 39.88,27.75 40.38,28.25 67.75,28.25 68.25,28.75 STM_CHIP.8
  Top 0.406: IC2.14 23.09,19.84 v23.12,18
  Bottom 0.406: v23.12,18 23.12,21.12 v24.5,22.5
SR_RST  (via drill 0.5, 0.6)
  Top 0.254: STM_CHIP.11 69.75,27.25 68.88,26.38 51.25,26.38 | 51.25,26.38 41.62,26.38 39.8,24.55 IC3.10 | 51.25,26.25 51.25,26.38
  Top 0.305: IC5.10 51.25,17.9 51.25,26.25
  Top 0.406: IC2.10 28.17,18.95 28.25,18.88 v28.25,16.25 | v39.88,16.25 39.88,19.62 IC3.10
  Bottom 0.406: v28.25,16.25 28.75,15.75 39.38,15.75 v39.88,16.25
SR_SHCP  (via drill 0.5, 0.6)
  Top 0.254: STM_CHIP.10 69.26,27.76 68.5,27 41.12,27 38.53,24.41 v38.53,24 IC3.11
  Top 0.305: v42,24 48.12,24 49.99,22.13 IC5.11
  Top 0.406: IC2.11 26.88,19.67 26.88,17.38 v27,17.25 | v38.5,17.38 38.5,19.67 IC3.11
  Bottom 0.305: v42,24 v38.53,24
  Bottom 0.406: v38.5,17.38 37.75,16.62 29.75,16.62 29.12,17.25 v27,17.25
SR_STCP  (via drill 0.5, 0.6)
  Top 0.254: STM_CHIP.9 68.75,28.25 68.12,27.62 40.62,27.62 37.26,24.26 v37.26,22.88 IC3.12
  Top 0.305: v41.25,22.88 48,22.88 48.73,22.15 IC5.12
  Top 0.406: v25.62,18.12 IC2.12 | v37.25,18.12 37.25,19.69 IC3.12
  Bottom 0.305: v41.25,22.88 v37.26,22.88
  Bottom 0.406: v37.25,18.12 36.5,17.38 30.38,17.38 27.88,19.88 25.62,19.88 v25.62,18.12
SWD_NRST  (via drill 0.6)
  Top 0.254: STM_CHIP.7 67.74,31.64 STM-C8.1
  Top 0.406: v57.5,29.38 66.62,29.38 67.1,29.85 STM-C8.1 | S1.2 S1.1
  Bottom 0.305: v57.5,29.38 57.5,22.5 58.25,21.75 59,21.75 59.88,22.63 S1.2
SWD_TCK  (via drill 0.6)
  Top 0.254: STM_CHIP.49 62.87,45.51 61.88,46.5 v61,46.5 | STM-SWD.2 64.25,85.23 64.25,82.62 63,81.38 63,80 62.62,79.62 59.75,79.62 59.25,79.12
  Top 0.406: 59.25,79.12 59.25,51.88 v61,50.12
  Bottom 0.406: v61,46.5 v61,50.12
SWD_TMS
  Top 0.254: STM_CHIP.46 65.76,48.26 66,48.5 66.38,48.5 66.62,48.75 66.62,51.75 66.12,52.25 61.12,52.25 60.12,53.25 | 60.12,78.62 60.62,79.12 64.5,79.12 64.88,79.5 64.88,81.38 65.12,81.62 66.5,81.62 66.75,81.88 66.75,87.25 66.12,87.88 61,87.88 60.44,87.31 STM-SWD.4
  Top 0.406: 60.12,53.25 60.12,78.62
TXN  (via drill 0.6)
  Top 0.254: 77.25,73.12 U2.1 78.08,72.7 79.5,74.12 79.5,75.5 v80.5,76.5
  Top 0.406: v80.5,80.88 ETH-R2.1
  Bottom 0.406: v80.5,76.5 v80.5,80.88 77.42,83.95 ETHERNET.2
TXP  (via drill 0.6)
  Top 0.254: U2.2 76.75,73.62 77.12,74 78.38,74 78.88,74.5 78.88,76.88 79.5,77.5 82.12,77.5 v82.5,77.12 82.25,77.38
  Top 0.406: v82.5,80.88 ETH-R1.1
  Bottom 0.406: ETHERNET.1 78.72,93.65 79.12,93.25 79.12,84.25 v82.5,80.88 v82.5,77.12
USIM_CLK  (1 unrouted)
  Top 0.406: SIM900-R2.2 48.12,55.88
USIM_DATA  (1 unrouted)
USIM_RESET  (2 unrouted)
  Top 0.406: SIM900-R1.2 50.5,55.88
  Bottom 0.406: 50.5,55.88 50.38,55.88
USIM_VCC  (4 unrouted)
  Bottom 0.406: 29,64.24 29,67.25 SIM_C1.2 SIM_C2.2
VBAT  (via drill 0.5)
  Top 0.254: v65.25,38 64.75,37.5 STM_CHIP.1
  Bottom 0.61: v65.25,38 53.25,38 52.15,36.9 BAT1.1
VCC  (via drill 0.6)  (1 unrouted)
  Top 0.254: STM-C9.1 72.75,33.65 STM-L1.2 73,34.5 72.75,34.75 71.25,34.75 70.76,35.24 STM_CHIP.13 70.76,37.61 70.38,38 68.88,38 67.88,39 67.88,40.25 69.88,42.25 69.88,45.38 70.75,46.25 72.88,46.25 74.75,48.12 75.5,48.12 76.5,49.12 76.5,56.25 v78.38,58.12 | 72.12,70 U2.15 68.88,70 68.38,70.5 68.38,71.97 W5500-C9.1 | U2.11 72.25,71.12 | 72.25,71.12 72.25,70.75 72.38,70.62 | v78.38,61 78.38,64.38 77,65.75 77,68.38 75.75,69.62 75.75,70.5 75.62,70.62 | W5500-C7.1 73.12,75 73.75,74.38 U2.8 73.75,70.75 | 75.62,70.62 75.75,70.75 U2.4 75.75,74.38 76.75,75.38 v76.75,75.88 W5500-C6.1 | 73.75,70.75 73.88,70.62 75.62,70.62 | 72.38,70.62 73.62,70.62 73.75,70.75 | 72.12,70 72.25,70.12 72.25,70.5 72.38,70.62 | 72.12,69 U2.17 68.38,69 67,70.38 67,70.47 W5500-C10.1 | 72.12,69 72.25,69.12 72.25,69.88 72.12,70 | 72.12,69 72.25,68.88 72.25,67.12 72.12,67 U2.21 66.97,67 W5500-C11.1 | 72.25,71.12 71.62,71.12
  Top 0.406: 71.62,71.12 69.62,73.12 69.62,74 v68.5,75.12 W5500-C8.1 | W5500-C12.+ 79.42,84.55 79.25,84.38 79.25,80.25 | 79.25,80.25 78.62,79.62 v78,79.62 ETH-R3.2 | ETH-R1.2 ETH-R2.2 80.35,79.15 79.25,80.25 | v23.5,82.12 SYS-R2.2
  Top 0.61: SYS-R2.2 23.5,82.15 22.22,82.15 21.4,82.97 SYS-C4.1
  Bottom 0.254: v78.38,61 v78.38,58.12
  Bottom 0.61: v76.75,75.88 78,77.12 v78,79.62
  Bottom 0.813: v68.5,75.12 66.88,76.75 55.12,76.75 55.12,67.12 53.88,65.88 50.38,65.88 | SYS-R2.2 v23.5,82.12
VDD  (via drill 0.5, 0.6)  (6 unrouted)
  Top 0.254: STM-C11.1 75.59,39.01 STM_CHIP.19 73.13,39.01 72.75,38.62 69,38.62 68.38,39.25 68.38,40 70.38,42 70.38,45.12 71,45.75 73.02,45.75 73.26,45.51 STM_CHIP.32 74.11,46.61 74.5,47 75.9,47 STM-C12.1 v76,47.12 | STM-C10.1 63.24,36.14 63.24,37.64 STM_CHIP.64 | U2.28 73.25,62.88 72.88,62.5 71.75,62.5 v70.62,61.38 | STM_CHIP.48 64.74,48.01 64.62,48.12 64.62,50.75 64.97,51.1 STM-C13.1 v65.62,51.12 | W5500-R9.2 83.97,59.35 | v73,32.38 STM-L1.1
  Top 0.406: IC2.16 20.56,20.8 21,21.25 31.5,21.25 v31.88,20.88 32.18,20.57 IC3.16 | STM-C12.1 77.5,48.6 LCD-R1.2 77.97,52.12 80.75,52.12 82.12,53.5 82.12,57.5 83.97,59.35 | STM-C1.2 STM-C10.1 v62,34.88 | IC1.P$57 IC1.P$56 IC1.P$55 | 52.75,85 SIM900-R7.2 | STM-C11.1 77.34,38.35 U$4.LCD_VCC | v27,83.5 SYS-C3.1 | W5500-C5.1 v70.62,61.38 | v84,71.5 W5500-R1.1 | ESP-VDD.1 58.96,4.33 62.75,8.12 73,8.12 74.75,9.88 v74.75,13.88 | v54.62,22.5 58.25,22.5 v58.75,23 | v44.88,21.62 43.65,20.39 IC5.16 | v80.88,23.12 80.38,23.12 v80.38,29.12
  Top 0.61: 84.25,59.5 W5500-R9.2 84.88,59.5 85.38,60 85.38,71 84.88,71.5 v84,71.5 | SYS-R2.1 25.23,82.85 25.88,83.5 26.98,83.5 SYS-C3.1 | STM-SWD.1 68.06,87.56 64.38,91.25 64.38,102.62 65.12,103.38 ETHERNET.12 67.92,105.55 68.88,106.5 79.75,106.5 80.58,105.67 ETHERNET.9 | W5500-R3.1 W5500-R2.1 W5500-R1.1
  Top 1.016: v15.5,77.25 11.88,80.88 v11.88,88.62 | 27.02,83.5 SYS-C3.1 | 22.12,85 23.12,84 26.5,84 v27,83.5
  Top 1.422: v23.25,99.38 24.98,97.64 PWR-SWT.1 21.25,89.39 21.25,85.88 22.12,85
  Bottom 0.254: v65.62,51.12 66.38,51.12 66.75,50.75 66.75,47.5 67.12,47.12 v76,47.12
  Bottom 0.305: 58.75,34.25 58.62,34.12 58.62,26.25 58.25,25.88 58.25,23.5 v58.75,23
  Bottom 0.406: 76,32 73.38,32 v73,32.38 71,32.38 68.5,34.88 v62,34.88 59.38,34.88 58.75,34.25 | 76,32 77.12,32 80.09,34.97 80.09,35.58 U$4.LCD_VCC | 54.25,85 57.25,82 66.58,82 66.58,82.02 STM-USART.1 STM-SWD.1 | v76,47.12 76,47.38 75.62,47.75 75.62,55 | 75.62,55 75.62,56.38 v70.62,61.38 70.62,63.42 W5500-C13.+ | W5500-R13.2 75.62,55 | 80.38,29.62 77.38,29.62 76,31 76,32 | 80.38,29.62 80.6,29.62 DHT-R1.1 82.53,31.15 84.62,33.25 SENSOR-DHT.1 | v31.88,20.88 32.62,21.62 v44.88,21.62 45.75,22.5 v54.62,22.5 | v74.75,13.88 80.5,13.88 80.88,14.25 v80.88,23.12 | v80.38,29.12 80.38,29.62
  Bottom 0.61: ETHERNET.9 80.6,104.9 85.38,100.12 85.38,72 84.88,71.5 v84,71.5
  Bottom 1.016: v11.88,88.62 22.62,99.38 v23.25,99.38
VESP
  Top 0.406: ESP-C1.1 | ESP-C1.1 63.6,21.7 U$5.VCC | ESP-GPIO0.1 74.96,1.12 61.5,1.12 ESP-VDD.2 61.5,5.62 63.12,7.25 73.75,7.25 76.34,9.84 76.34,15.98 73.6,18.73 U$5.CH_PD 73.6,23.42 71.74,25.28 66.43,25.28 65.65,24.5 ESP-C1.1
VEXT
  Bottom 0.406: ESP-UART-A.1 84.75,23.44 84.75,6.62 81.62,3.5 81.62,1.75 81,1.12 64.04,1.12 ESP-VDD.3